# Altium schematic sheet main_stack_dual_channel.SchDoc
size A
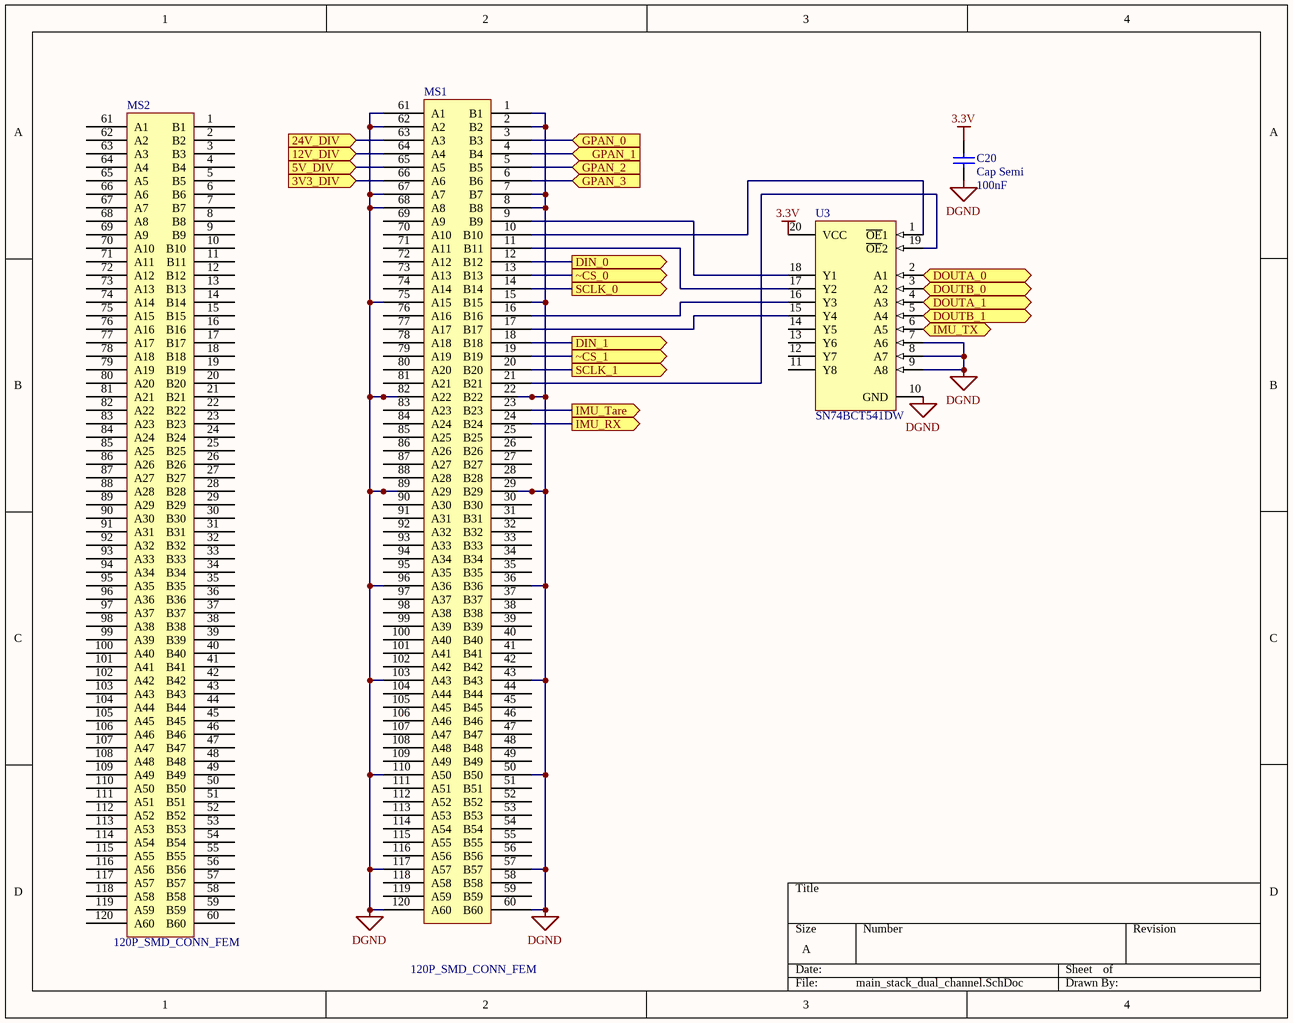
[diagram p0: main_stack_dual_channel.SchDoc]

## Parts
C20  Cap Semi  value 100nF  [C0805]
MS1  120P_SMD_CONN_FEM
MS2  120P_SMD_CONN_FEM
U3  SN74BCT541DW  [DW020_N]

## Ports
3V3_DIV (in), 5V_DIV (in), 12V_DIV (in), 24V_DIV (in), DIN_0 (out), DIN_1 (out), DOUTA_0 (in), DOUTA_1 (in), DOUTB_0 (in), DOUTB_1 (in), GPAN_0 (in), GPAN_1 (in), GPAN_2 (in), GPAN_3 (in), IMU_RX (out), IMU_Tare (out), IMU_TX (in), SCLK_0 (out), SCLK_1 (out), ~CS_0 (out), ~CS_1 (out)

## Nets
3.3V: C20.2 U3.20(VCC)
DGND: C20.1 MS1.1(B1) MS1.2(B2) MS1.7(B7) MS1.8(B8) MS1.15(B15) MS1.22(B22) MS1.29(B29) MS1.36(B36) MS1.43(B43) MS1.50(B50) MS1.57(B57) MS1.60(B60) MS1.61(A1) MS1.62(A2) MS1.67(A7) MS1.68(A8) MS1.75(A15) MS1.82(A22) MS1.89(A29) MS1.96(A36) MS1.103(A43) MS1.110(A50) MS1.117(A57) MS1.120(A60) U3.7(A6) U3.8(A7) U3.9(A8) U3.10(GND)
3V3_DIV: MS1.66(A6) ; port 3V3_DIV
5V_DIV: MS1.65(A5) ; port 5V_DIV
12V_DIV: MS1.64(A4) ; port 12V_DIV
24V_DIV: MS1.63(A3) ; port 24V_DIV
DIN_0: MS1.12(B12) ; port DIN_0
DIN_1: MS1.18(B18) ; port DIN_1
DOUTA_0: U3.2(A1) ; port DOUTA_0
DOUTA_1: U3.4(A3) ; port DOUTA_1
DOUTB_0: U3.3(A2) ; port DOUTB_0
DOUTB_1: U3.5(A4) ; port DOUTB_1
GPAN_0: MS1.3(B3) ; port GPAN_0
GPAN_1: MS1.4(B4) ; port GPAN_1
GPAN_2: MS1.5(B5) ; port GPAN_2
GPAN_3: MS1.6(B6) ; port GPAN_3
IMU_RX: MS1.24(B24) ; port IMU_RX
IMU_Tare: MS1.23(B23) ; port IMU_Tare
IMU_TX: U3.6(A5) ; port IMU_TX
SCLK_0: MS1.14(B14) ; port SCLK_0
SCLK_1: MS1.20(B20) ; port SCLK_1
~CS_0: MS1.13(B13) ; port ~CS_0
~CS_1: MS1.19(B19) ; port ~CS_1
NetMS1_9: MS1.9(B9) U3.18(Y1)
NetMS1_10: MS1.10(B10) U3.1(~{OE}1)
NetMS1_11: MS1.11(B11) U3.17(Y2)
NetMS1_16: MS1.16(B16) U3.16(Y3)
NetMS1_17: MS1.17(B17) U3.15(Y4)
NetMS1_21: MS1.21(B21) U3.19(~{OE}2)

Not connected (* = marked no-connect by the designer): MS1 25(B25) 26(B26) 27(B27) 28(B28) 30(B30) 31(B31) 32(B32) 33(B33) 34(B34) 35(B35) 37(B37) 38(B38) 39(B39) 40(B40) 41(B41) 42(B42) 44(B44) 45(B45) 46(B46) 47(B47) 48(B48) 49(B49) 51(B51) 52(B52) 53(B53) 54(B54) 55(B55) 56(B56) 58(B58) 59(B59) 69(A9) 70(A10) 71(A11) 72(A12) 73(A13) 74(A14) 76(A16) 77(A17) 78(A18) 79(A19) 80(A20) 81(A21) 83(A23) 84(A24) 85(A25) 86(A26) 87(A27) 88(A28) 90(A30) 91(A31) 92(A32) 93(A33) 94(A34) 95(A35) 97(A37) 98(A38) 99(A39) 100(A40) 101(A41) 102(A42) 104(A44) 105(A45) 106(A46) 107(A47) 108(A48) 109(A49) 111(A51) 112(A52) 113(A53) 114(A54) 115(A55) 116(A56) 118(A58) 119(A59); MS2 1(B1) 2(B2) 3(B3) 4(B4) 5(B5) 6(B6) 7(B7) 8(B8) 9(B9) 10(B10) 11(B11) 12(B12) 13(B13) 14(B14) 15(B15) 16(B16) 17(B17) 18(B18) 19(B19) 20(B20) 21(B21) 22(B22) 23(B23) 24(B24) 25(B25) 26(B26) 27(B27) 28(B28) 29(B29) 30(B30) 31(B31) 32(B32) 33(B33) 34(B34) 35(B35) 36(B36) 37(B37) 38(B38) 39(B39) 40(B40) 41(B41) 42(B42) 43(B43) 44(B44) 45(B45) 46(B46) 47(B47) 48(B48) 49(B49) 50(B50) 51(B51) 52(B52) 53(B53) 54(B54) 55(B55) 56(B56) 57(B57) 58(B58) 59(B59) 60(B60) 61(A1) 62(A2) 63(A3) 64(A4) 65(A5) 66(A6) 67(A7) 68(A8) 69(A9) 70(A10) 71(A11) 72(A12) 73(A13) 74(A14) 75(A15) 76(A16) 77(A17) 78(A18) 79(A19) 80(A20) 81(A21) 82(A22) 83(A23) 84(A24) 85(A25) 86(A26) 87(A27) 88(A28) 89(A29) 90(A30) 91(A31) 92(A32) 93(A33) 94(A34) 95(A35) 96(A36) 97(A37) 98(A38) 99(A39) 100(A40) 101(A41) 102(A42) 103(A43) 104(A44) 105(A45) 106(A46) 107(A47) 108(A48) 109(A49) 110(A50) 111(A51) 112(A52) 113(A53) 114(A54) 115(A55) 116(A56) 117(A57) 118(A58) 119(A59) 120(A60); U3 11(Y8) 12(Y7) 13(Y6) 14(Y5)

## Library data of the parts
C20 = Cap Semi: Capacitor (Semiconductor SIM Model); Published: 8-Jun-2000; LatestRevisionDate: 29-May-2009; LatestRevisionNote: IPC-7351 Footprint Added.; PackageReference: C1206; Publisher: Altium Limited; PackageDescription: Chip Capacitor
MS1 MS2 = 120P_SMD_CONN_FEM: Main Stack Connector, Female; Part Number: FX2-120P-1.27SV(71)
U3 = SN74BCT541DW: Octal Buffer/Driver with 3-State Outputs; ComponentAvailability: Obsolete; Published: 8-Jun-2000; LatestRevisionDate: 13-Apr-2006; LatestRevisionNote: IPC-7351 Footprint Added.; DatasheetVersion: Apr-1994; PackageVersion: Mar-2000; PackageReference: DW020; Publisher: Altium Limited; PackageDescription: 20-Pin Plastic Small Outline Integrated Circuit 1.27 mm Pitch; Code_JEDEC: MS-013; Code_IPC: SOIC127P1030-20; ComponentLink1Description: Manufacturer Link; ComponentLink1URL: http://www.ti.com/; ComponentLink2Description: Discontinuation Notice; ComponentLink2URL: http://focus.ti.com/docs/prod/folders/print/sn74bct541.html